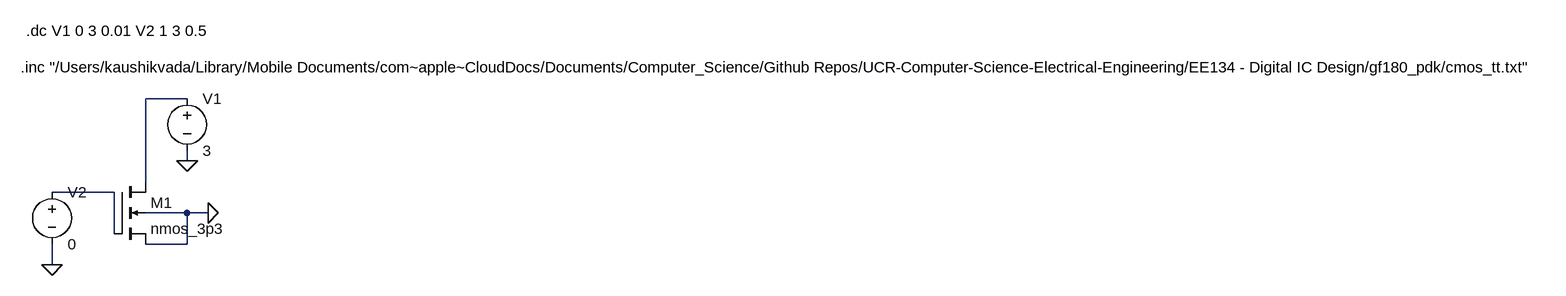
[diagram p0: schematic NMOS.asc]
NMOS.asc, the LTspice schematic file:
Version 4
SHEET 1 2388 680
WIRE 288 -48 224 -48
WIRE 288 48 288 32
WIRE 224 80 224 -48
WIRE 176 96 80 96
WIRE 288 128 224 128
WIRE 320 128 288 128
WIRE 176 160 176 96
WIRE 288 176 288 128
WIRE 288 176 224 176
WIRE 80 208 80 176
FLAG 80 208 0
FLAG 288 48 0
FLAG 320 128 0
SYMBOL nmos4 176 80 R0
SYMATTR InstName M1
SYMATTR Value nmos_3p3
SYMATTR Value2 l=1u w=2u
SYMBOL Voltage 288 -64 R0
SYMATTR InstName V1
SYMATTR Value 3
SYMBOL Voltage 80 80 R0
SYMATTR InstName V2
SYMATTR Value 0
TEXT 32 -96 Left 2 !.inc "/Users/kaushikvada/Library/Mobile Documents/com~apple~CloudDocs/Documents/Computer_Science/Github Repos/UCR-Computer-Science-Electrical-Engineering/EE134 - Digital IC Design/gf180_pdk/cmos_tt.txt"
TEXT 40 -152 Left 2 !.dc V1 0 3 0.01 V2 1 3 0.5

The netlist it stands for:
* NMOS.asc
M1 N001 N002 0 0 nmos_3p3 l=1u w=2u
V1 N001 0 3
V2 N002 0 0
.model NMOS NMOS
.model PMOS PMOS
.lib standard.mos
.inc "/Users/kaushikvada/Library/Mobile Documents/com~apple~CloudDocs/Documents/Computer_Science/Github Repos/UCR-Computer-Science-Electrical-Engineering/EE134 - Digital IC Design/gf180_pdk/cmos_tt.txt"
.dc V1 0 3 0.01 V2 1 3 0.5
.backanno
.end